# EAGLE design Robot_Board_v003 (EAGLE 6.5.0)
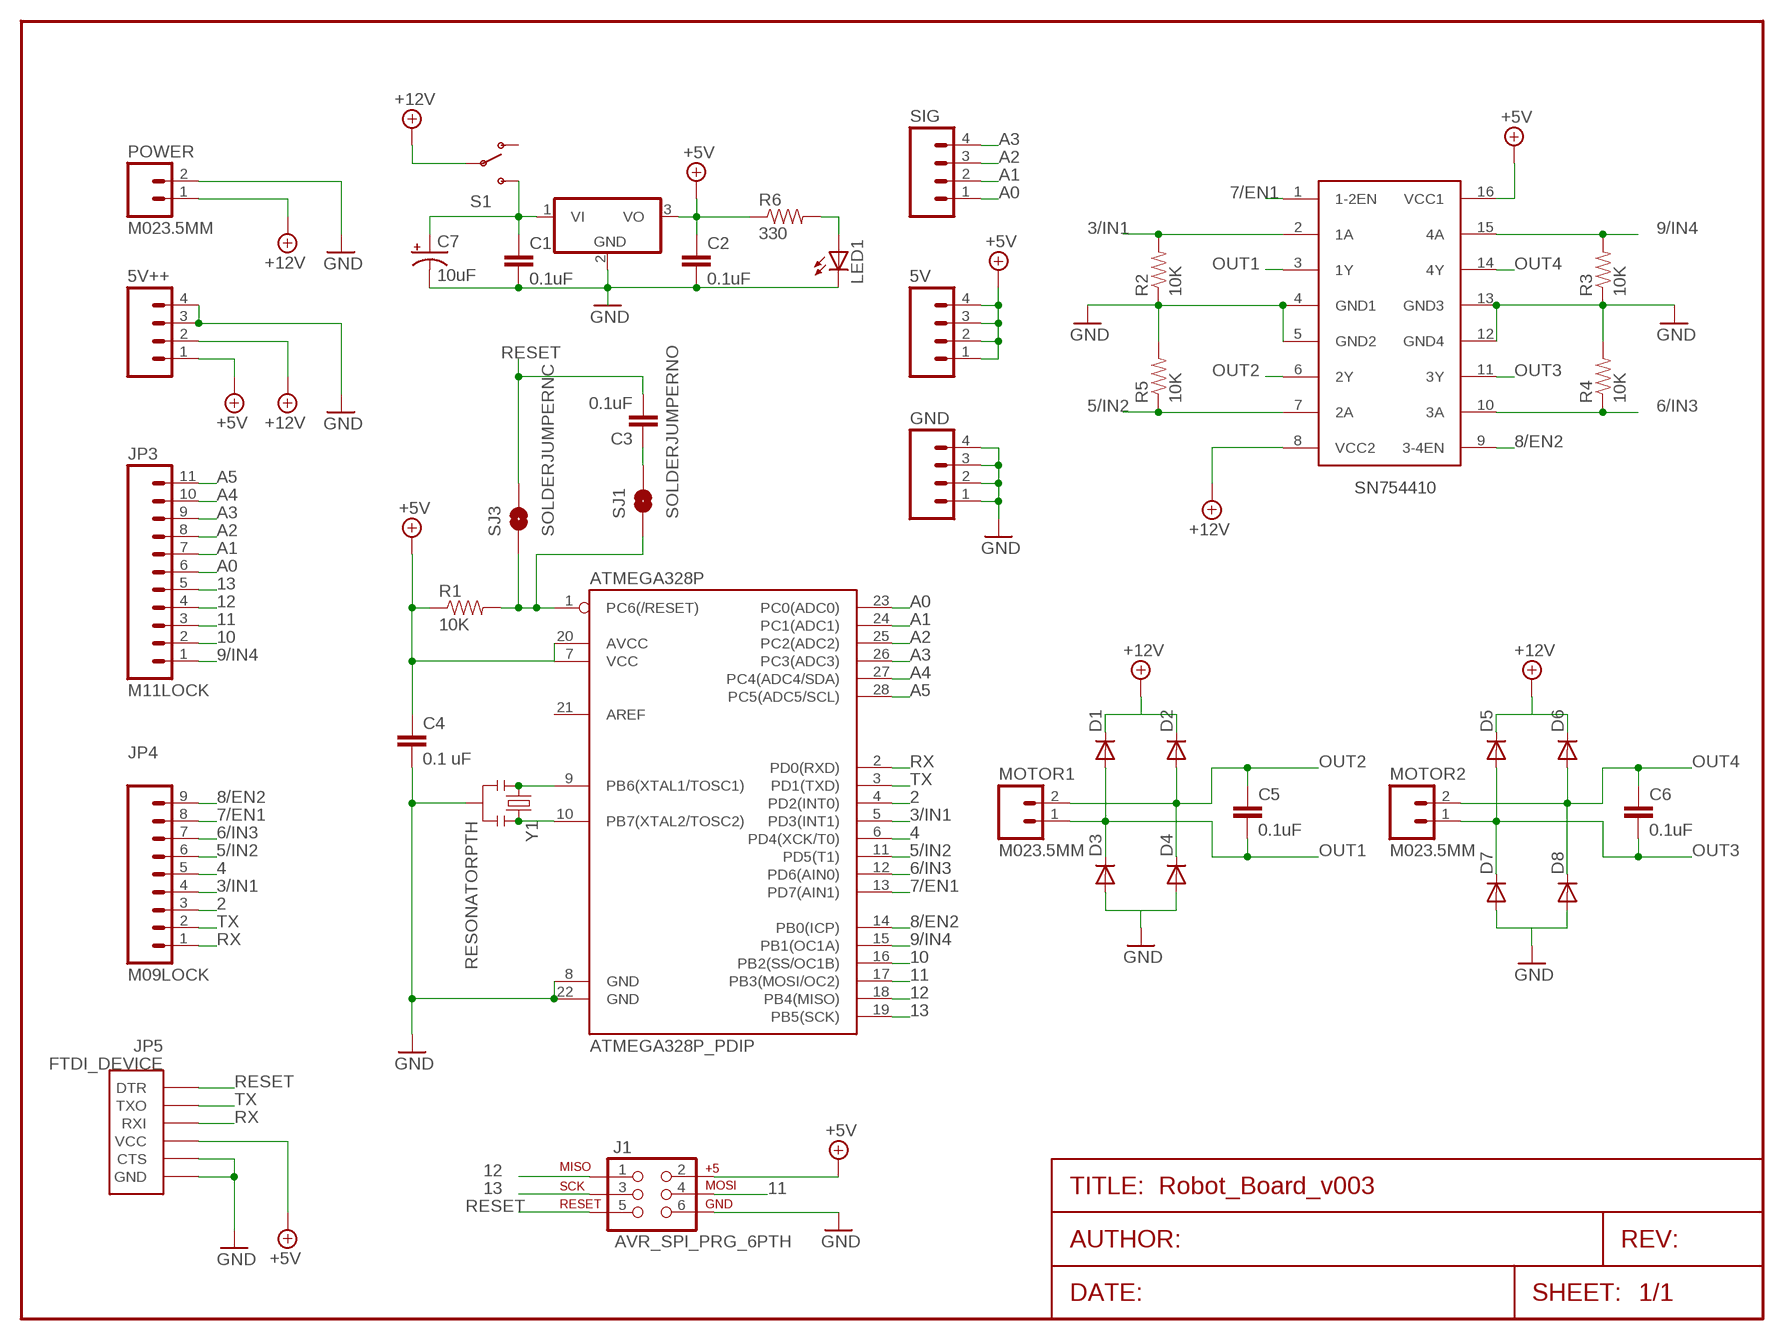
[diagram p0: schematic, sheet 1]

## Parts
5V  M04PTH  [1X04]
5V++  M04LOCK  [1X04_LOCK]
7805  7805TV  [TO220V]
ATMEGA328P  ATMEGA328P_PDIP  [DIL28-3]
C1  0.1uF  CAPPTH1  [CAP-PTH-5MM]
C2  0.1uF  CAPPTH1  [CAP-PTH-5MM]
C3  0.1uF  CAPPTH1  [CAP-PTH-5MM]
C4  0.1 uF  CAPPTH1  [CAP-PTH-5MM]
C5  0.1uF  CAPPTH1  [CAP-PTH-5MM]
C6  0.1uF  CAPPTH1  [CAP-PTH-5MM]
C7  10uF  CAP_POLPTH2  [CPOL-RADIAL-10UF-25V]
D1  DIODEPTH  [DIODE-1N4001]
D2  DIODEPTH  [DIODE-1N4001]
D3  DIODEPTH  [DIODE-1N4001]
D4  DIODEPTH  [DIODE-1N4001]
D5  DIODEPTH  [DIODE-1N4001]
D6  DIODEPTH  [DIODE-1N4001]
D7  DIODEPTH  [DIODE-1N4001]
D8  DIODEPTH  [DIODE-1N4001]
GND  M04PTH  [1X04]
J1  AVR_SPI_PRG_6PTH  [2X3]
JP3  M11LOCK  [1X11_LOCK]
JP4  M09LOCK  [1X09_LOCK]
JP5  FTDI_DEVICE  [FTDI_DEVICE_SIDE]
LED1  LED3MM  [LED3MM]
MOTOR1  M023.5MM  [SCREWTERMINAL-3.5MM-2]
MOTOR2  M023.5MM  [SCREWTERMINAL-3.5MM-2]
POWER  M023.5MM  [SCREWTERMINAL-3.5MM-2]
R1  10K  RESISTORPTH-1/4W  [AXIAL-0.4]
R2  10K  RESISTORPTH-1/4W  [AXIAL-0.4]
R3  10K  RESISTORPTH-1/4W  [AXIAL-0.4]
R4  10K  RESISTORPTH-1/4W  [AXIAL-0.4]
R5  10K  RESISTORPTH-1/4W  [AXIAL-0.4]
R6  330  RESISTORPTH-1/4W  [AXIAL-0.4]
S1  SWITCH-SPDTPTH  [SWITCH-SPDT]
SIG  M04PTH  [1X04]
SJ1  SOLDERJUMPERNO  [SJ_2S-NO]
SJ3  SOLDERJUMPERNC  [SJ_2S]
SN754410  L293D  [DIL16]
Y1  RESONATORPTH  [RESONATOR-PTH]

## Nets
2: ATMEGA328P.4(PD2(INT0)) JP4.3
3/IN1: ATMEGA328P.5(PD3(INT1)) JP4.4 R2.P$2 SN754410.2(1A)
4: ATMEGA328P.6(PD4(XCK/T0)) JP4.5
5/IN2: ATMEGA328P.11(PD5(T1)) JP4.6 R5.P$1 SN754410.7(2A)
6/IN3: ATMEGA328P.12(PD6(AIN0)) JP4.7 R4.P$1 SN754410.10(3A)
7/EN1: ATMEGA328P.13(PD7(AIN1)) JP4.8 SN754410.1(1-2EN)
8/EN2: ATMEGA328P.14(PB0(ICP)) JP4.9 SN754410.9(3-4EN)
9/IN4: ATMEGA328P.15(PB1(OC1A)) JP3.1 R3.P$2 SN754410.15(4A)
10: ATMEGA328P.16(PB2(SS/OC1B)) JP3.2
11: ATMEGA328P.17(PB3(MOSI/OC2)) J1.4 JP3.3
12: ATMEGA328P.18(PB4(MISO)) J1.1 JP3.4
13: ATMEGA328P.19(PB5(SCK)) J1.3 JP3.5
+5V [5V]: 5V++.1 5V.1 5V.2 5V.3 5V.4 7805.3(VO) ATMEGA328P.7(VCC) ATMEGA328P.20(AVCC) C2.1 C4.1 J1.2 JP5.P$4(VCC) R1.P$1 R6.P$1 SN754410.16(VCC1)
+12V [Power]: 5V++.2 D1.C D2.C D5.C D6.C POWER.1 S1.2(P) SN754410.8(VCC2)
A0: ATMEGA328P.23(PC0(ADC0)) JP3.6 SIG.1
A1: ATMEGA328P.24(PC1(ADC1)) JP3.7 SIG.2
A2: ATMEGA328P.25(PC2(ADC2)) JP3.8 SIG.3
A3: ATMEGA328P.26(PC3(ADC3)) JP3.9 SIG.4
A4: ATMEGA328P.27(PC4(ADC4/SDA)) JP3.10
A5: ATMEGA328P.28(PC5(ADC5/SCL)) JP3.11
GND [Power]: 5V++.3 5V++.4 7805.2(GND) ATMEGA328P.8(GND) ATMEGA328P.22(GND) C1.2 C2.2 C4.2 C7.2(-) D3.A D4.A D7.A D8.A GND.1 GND.2 GND.3 GND.4 J1.6 JP5.P$5(CTS) JP5.P$6(GND) LED1.K(C) POWER.2 R2.P$1 R3.P$1 R4.P$2 R5.P$2 SN754410.4(GND1) SN754410.5(GND2) SN754410.12(GND4) SN754410.13(GND3) Y1.2
N$1: ATMEGA328P.9(PB6(XTAL1/TOSC1)) Y1.1
N$2: ATMEGA328P.10(PB7(XTAL2/TOSC2)) Y1.3
N$3: ATMEGA328P.1(PC6(/RESET)) R1.P$2 SJ1.1 SJ3.1
N$4: C3.1 SJ1.2
N$5 [Power]: 7805.1(VI) C1.1 C7.1(+) S1.3(S)
N$6: LED1.A R6.P$2
OUT1 [Power]: C5.2 D1.A D3.C MOTOR1.1 SN754410.3(1Y)
OUT2 [Power]: C5.1 D2.A D4.C MOTOR1.2 SN754410.6(2Y)
OUT3 [Power]: C6.2 D5.A D7.C MOTOR2.1 SN754410.11(3Y)
OUT4 [Power]: C6.1 D6.A D8.C MOTOR2.2 SN754410.14(4Y)
RESET: C3.2 J1.5 JP5.P$1(DTR) SJ3.2
RX: ATMEGA328P.2(PD0(RXD)) JP4.1 JP5.P$3(RXI)
TX: ATMEGA328P.3(PD1(TXD)) JP4.2 JP5.P$2(TXO)
Unconnected: ATMEGA328P.21(AREF) S1.1(O)

## Library data of the parts
5V 5V++ GND SIG = SparkFun-Connectors:M04: Header 4 Standard 4-pin 0.1" header. Use with straight break away headers (SKU : PRT-00116), right angle break away headers (PRT-00553), swiss pins (PRT-00743), machine pins (PRT-00117), and female headers (PRT-00115). Molex polarized connector foot print use with SKU : PRT-08231 with associated crimp pins and housings. 1MM SMD Version SKU: PRT-10208
7805 = linear:78*: Positive VOLTAGE REGULATOR Source: http://cache.national.com/ds/LM/LM78L05.pdf http://www.fairchildsemi.com/ds/LM/LM7805.pdf
ATMEGA328P = SparkFun-DigitalIC:ATMEGA328P_PDIP: uC used in the Arduino 32kb flash, 1k EEPROM, 2k SRAM This is the through-hole version of this chip.
C1-C6 = SparkFun-Passives:CAP: Capacitor Standard 0603 ceramic capacitor, and 0.1" leaded capacitor.
C7 = SparkFun-Passives:CAP_POL: Capacitor Polarized These are standard SMD and PTH capacitors. Normally 10uF, 47uF, and 100uF in electrolytic and tantalum varieties. Always verify the external diameter of the through hole cap, it varies with capacity, voltage, and manufacturer. The EIA devices should be standard.
D1-D8 = SparkFun-DiscreteSemi:DIODE: Diode These are standard reverse protection diodes and small signal diodes. SMA package can handle up to about 1A. SOD-323 can handle about 200mA. What the SOD-323 package when ordering, there are some mfgs out there that are 5-pin packages.
J1 = SparkFun-Connectors:AVR_SPI_PRG_6: AVR ISP 6 Pin This is the reduced ISP connector for AVR programming. Common on Arduino. This footprint will take up less PCB space and can be used with a 10-pin to 6-pin adapter such as SKU: BOB-08508
JP3 = SparkFun-Connectors:M11: Header 11 Standard 11-pin 0.1" header. Use with straight break away headers (SKU : PRT-00116), right angle break away headers (PRT-00553), swiss pins (PRT-00743), machine pins (PRT-00117), and female headers (PRT-00115).
JP4 = SparkFun-Connectors:M09: Header 9 Standard 9-pin 0.1" header. Use with straight break away headers (SKU : PRT-00116), right angle break away headers (PRT-00553), swiss pins (PRT-00743), machine pins (PRT-00117), and female headers (PRT-00115).
JP5 = SparkFun-Connectors:FTDI_DEVICE: Connector which mates to FTDI basic or FTDI cable.
LED1 = SparkFun-LED:LED: LEDs Standard schematic elements and footprints for 5mm, 3mm, 1206, and 0603 sized LEDs. 5mm - Spark Fun Electronics SKU : COM-00529 (and others)
MOTOR1 MOTOR2 POWER = SparkFun-Connectors:M02: Standard 2-pin 0.1" header. Use with - straight break away headers ( PRT-00116) - right angle break away headers (PRT-00553) - swiss pins (PRT-00743) - machine pins (PRT-00117) - female headers (PRT-00115) Molex polarized connector foot print use with: PRT-08233 with associated crimp pins and housings. 2.54_SCREWTERM for use with PRT-10571. 3.5mm Screw Terminal footprints for PRT-08084 5mm Screw Terminal footprints for use with PRT-08433
R1-R6 = SparkFun-Passives:RESISTOR: Resistor Basic schematic elements and footprints for 0603, 1206, and PTH resistors.
S1 = SparkFun-Electromechanical:SWITCH-SPDT: SPDT Switch Simple slide switch, Spark Fun Electronics SKU : COM-00102 DPDT SMT slide switch, AYZ0202, SWCH-08179
SJ1 SJ3 = SparkFun-Passives:SOLDERJUMPER: Solder Jumper Standard SMD solder jumper. Used to automate production. Two varients : Normally Open and Normally Closed are the same, but have different paste layers. NC will have a large amount of paste and should jumper during reflow.
SN754410 = st-microelectronics:L293D: PUSH-PULL 4 CHANNEL DRIVER; MPN: L293D; OC_FARNELL: 9589619; OC_NEWARK: 56P8249
Y1 = SparkFun-FreqCtrl:RESONATOR: Resonator Small SMD resonator. This is the itty bitty 10/20MHz resonators with built in caps. CSTCE10M0G55 and CSTCE20M0V53. Footprint has been reviewed closely but hasn't been tested yet.

## Net classes
0 default: width 0.254 mm, clearance 0.203 mm
1 Power: width 1.27 mm, clearance 0.203 mm
2 5V: width 0.406 mm, clearance 0.203 mm

## Board
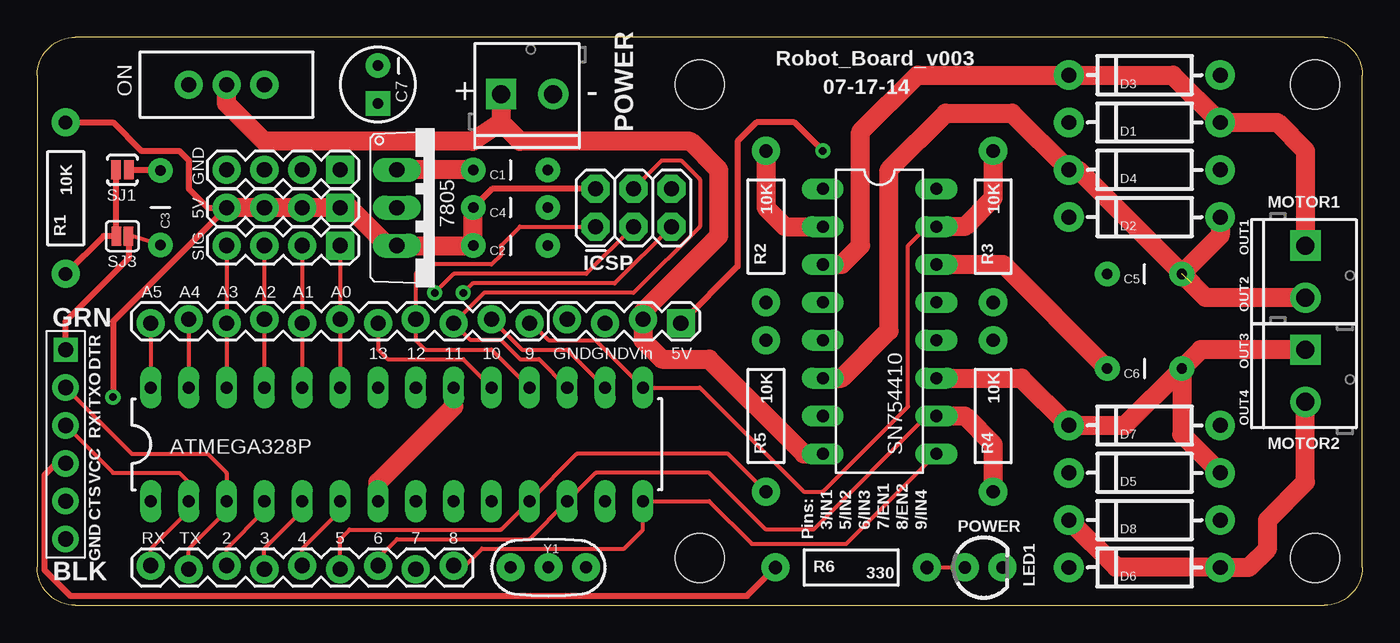
[diagram p1: board, top side]
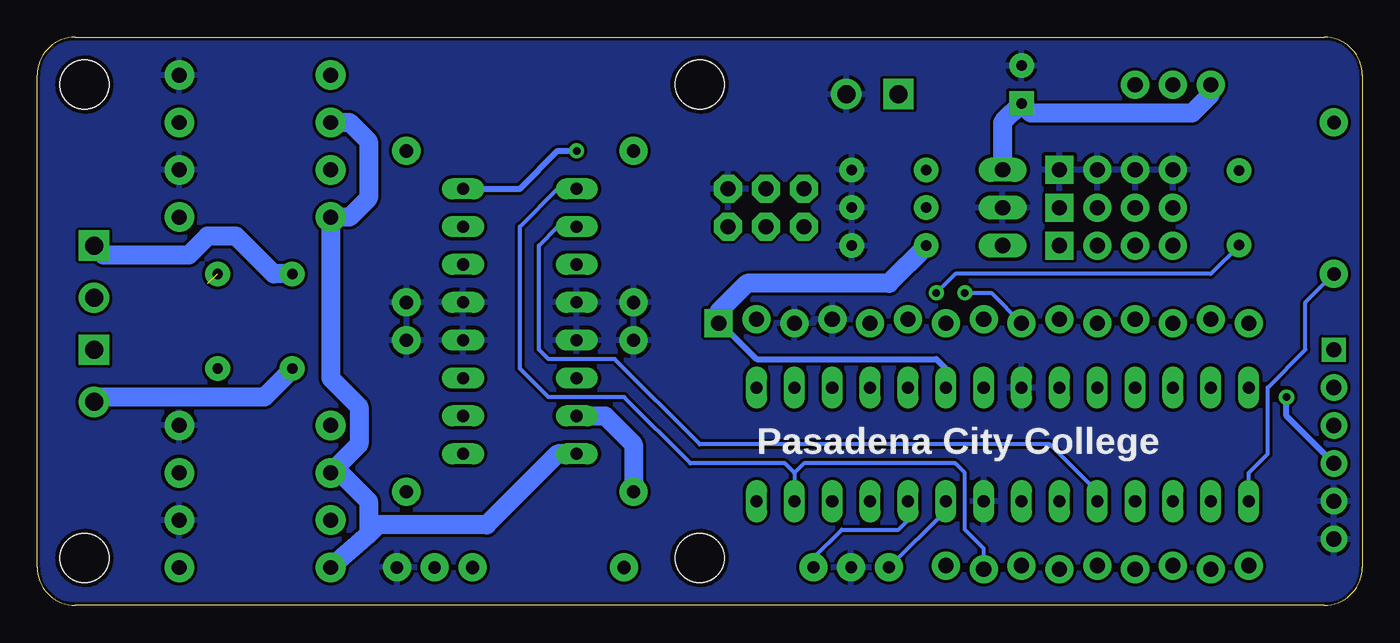
[diagram p2: board, bottom side, seen from below]

Size 88.9 x 38.1 mm. Coordinates in mm from the lower left corner, seen from the top.
Outline: 2.54,0 86.36,0 arc90 88.9,2.54 88.9,35.56 arc90 86.36,38.1 2.54,38.1 arc90 0,35.56 0,2.54 arc90 2.54,0
Copper layers (1*16): Top 0.035mm / dielectric 1.5mm / Bottom 0.035mm
Design rules "ai_2layer": minimum track width 7mil, minimum drill 15mil, track to track 8mil, track to pad 8mil, pad to pad 8mil, via to via 8mil, smd to smd 8mil, copper to edge 8mil, drill to drill 8mil, minimum pad ring 12mil, minimum via ring 10mil, stop-mask expansion 4mil, vias tented up to drill 20mil, thermal gap 10mil

### Footprints (pad centres in the part's own frame; a part is rotated, then mirrored left to right if it is on the bottom)
1X04 = drill 1.016 pad 1.88 square: 1 0,0 | drill 1.016 pad 1.88: 2 2.54,0; 3 5.08,0; 4 7.62,0
1X04_LOCK = drill 1.016 pad 1.88 square: 1 0,0.127 | drill 1.016 pad 1.88: 2 2.54,-0.127; 3 5.08,0.127; 4 7.62,-0.127
TO220V = drill 1.016 long: 1 -2.54,-2.54; 2 0,-2.54; 3 2.54,-2.54
DIL28-3 = drill 0.813 long: 1 -16.51,-3.81; 2 -13.97,-3.81; 3 -11.43,-3.81; 4 -8.89,-3.81; 5 -6.35,-3.81; 6 -3.81,-3.81; 7 -1.27,-3.81; 8 1.27,-3.81; 9 3.81,-3.81; 10 6.35,-3.81; 11 8.89,-3.81; 12 11.43,-3.81; 13 13.97,-3.81; 14 16.51,-3.81; 15 16.51,3.81; 16 13.97,3.81; 17 11.43,3.81; 18 8.89,3.81; 19 6.35,3.81; 20 3.81,3.81; 21 1.27,3.81; 22 -1.27,3.81; 23 -3.81,3.81; 24 -6.35,3.81; 25 -8.89,3.81; 26 -11.43,3.81; 27 -13.97,3.81; 28 -16.51,3.81
CAP-PTH-5MM = drill 0.7 pad 1.651: 1 -2.5,0; 2 2.5,0
CPOL-RADIAL-10UF-25V = drill 0.7 pad 1.651 square: 1 1.27,0 | drill 0.7 pad 1.651: 2 -1.27,0
DIODE-1N4001 = drill 1 pad 1.981: A -5.08,0; C 5.08,0
2X3 = drill 1.016 pad 1.88 octagon: 1 0,0; 2 0,2.54; 3 2.54,0; 4 2.54,2.54; 5 5.08,0; 6 5.08,2.54
1X11_LOCK = drill 1.016 pad 1.88: 1 0,0.127; 2 2.54,-0.127; 3 5.08,0.127; 4 7.62,-0.127; 5 10.16,0.127; 6 12.7,-0.127; 7 15.24,0.127; 8 17.78,-0.127; 9 20.32,0.127; 10 22.86,-0.127; 11 25.4,0.127
1X09_LOCK = drill 1.016 pad 1.88: 1 0,0.127; 2 2.54,-0.127; 3 5.08,0.127; 4 7.62,-0.127; 5 10.16,0.127; 6 12.7,-0.127; 7 15.24,0.127; 8 17.78,-0.127; 9 20.32,0.127
FTDI_DEVICE_SIDE = drill 1 square: P$1 -6.35,0 | drill 1.016 pad 1.778: P$2 -3.81,0; P$3 -1.27,0; P$4 1.27,0; P$5 3.81,0; P$6 6.35,0
LED3MM = drill 0.813 pad 1.88: A -1.27,0; K 1.27,0
SCREWTERMINAL-3.5MM-2 = drill 1.2 pad 2.032 square: 1 0,0 | drill 1.2 pad 2.032: 2 3.5,0
AXIAL-0.4 = drill 0.9 pad 1.88: P$1 -5.08,0; P$2 5.08,0
SWITCH-SPDT = drill 1.016 pad 1.88: 1 0,2.54; 2 0,0; 3 0,-2.54
SJ_2S-NO = smd 0.635 x 1.27: 1 -0.45,0; 2 0.45,0
SJ_2S = smd 0.635 x 1.27: 1 -0.412,0; 2 0.412,0
DIL16 = drill 0.813 long: 1 -8.89,-3.81; 2 -6.35,-3.81; 3 -3.81,-3.81; 4 -1.27,-3.81; 5 1.27,-3.81; 6 3.81,-3.81; 7 6.35,-3.81; 8 8.89,-3.81; 9 8.89,3.81; 10 6.35,3.81; 11 3.81,3.81; 12 1.27,3.81; 13 -1.27,3.81; 14 -3.81,3.81; 15 -6.35,3.81; 16 -8.89,3.81
STAND-OFF = hole 3.302: 0,0
RESONATOR-PTH = drill 0.8 pad 1.88: 1 -2.54,0; 2 0,0; 3 2.54,0

### Placement (x,y rotation side)
5V  20.32,26.67 180 top
5V++  43.18,19.05 180 top
7805  26.67,26.67 270 top
ATMEGA328P  24.13,10.79 0 top
C1  31.75,29.21 0 top
C2  31.75,24.13 0 top
C3  8.26,26.67 270 top
C4  31.75,26.67 0 top
C5  74.3,22.23 180 top
C6  74.3,15.88 0 top
C7  22.86,34.92 270 top
D1  74.3,32.38 180 top
D2  74.3,26.04 180 top
D3  74.3,35.56 180 top
D4  74.3,29.21 180 top
D5  74.3,8.89 180 top
D6  74.3,2.54 180 top
D7  74.3,12.06 180 top
D8  74.3,5.71 180 top
GND  20.32,29.21 180 top
J1  37.47,25.4 0 top
JP3  33.02,19.05 180 top
JP4  7.62,2.54 0 top
JP5  1.91,10.79 270 top
LED1  63.5,2.54 0 top
MOTOR1  85.09,24.13 270 top
MOTOR2  85.09,17.14 270 top
POWER  31.11,34.29 0 top
R1  1.91,27.3 270 top
R2  48.9,25.4 90 top
R3  64.14,25.4 90 top
R4  64.14,12.7 90 top
R5  48.9,12.7 90 top
R6  54.61,2.54 0 top
S1  12.7,34.92 270 top
SIG  20.32,24.13 180 top
SJ1  5.71,29.21 0 top
SJ3  5.71,24.77 0 top
SN754410  56.52,19.05 270 top
U$1  [STAND-OFF]  85.72,3.17 0 top
U$2  [STAND-OFF]  85.72,34.92 0 top
U$3  [STAND-OFF]  44.45,3.17 0 top
U$4  [STAND-OFF]  44.45,34.92 0 top
Y1  34.29,2.54 0 top

### Tracks (layer width: path | path; a pad name or v marks a point on that pad's centre or on a via)
2
  Top 0.254: JP4.3 12.7,3.81 15.24,6.35 ATMEGA328P.4
3/IN1
  Top 0.254: JP4.4 15.24,3.81 17.78,6.35 ATMEGA328P.5
  Top 1.27: R2.P$2 48.9,26.67 50.16,25.4 SN754410.2
  Bottom 0.254: ATMEGA328P.5 17.78,7.62 20.95,10.79 44.45,10.79 50.16,16.51 54.61,16.51 55.24,17.14 55.24,24.13 53.98,25.4 SN754410.2
4
  Top 0.254: JP4.5 17.78,3.81 20.32,6.35 ATMEGA328P.6
5/IN2
  Top 0.254: JP4.6 20.32,4.45 20.95,5.08 31.11,5.08 ATMEGA328P.11 36.2,10.16 46.35,10.16 R5.P$1
  Bottom 1.27: SN754410.7 50.8,12.7 48.9,10.79 R5.P$1
6/IN3
  Top 0.254: SN754410.10 59.69,12.7 52.07,5.08 48.9,5.08 45.09,8.89 37.47,8.89 ATMEGA328P.12 33.02,4.45 24.13,4.45 22.86,3.17 JP4.7
  Top 1.27: SN754410.10 62.23,12.7 64.14,10.79 R4.P$1
7/EN1
  Bottom 0.254: JP4.8 25.4,3.81 26.67,5.08 26.67,8.89 27.3,9.53 37.47,9.53 38.1,8.89 | SN754410.1 53.98,27.94 56.52,25.4 56.52,15.88 54.61,13.97 49.53,13.97 45.09,9.53 38.73,9.53 38.1,8.89 | 38.1,8.89 ATMEGA328P.13
8/EN2
  Top 0.254: JP4.9 28.7,2.67 29.84,3.81 39.37,3.81 40.64,5.08 ATMEGA328P.14 45.09,6.99 47.94,4.13 54.29,4.13 SN754410.9
9/IN4
  Top 0.254: JP3.1 33.15,18.92 34.29,17.78 37.47,17.78 ATMEGA328P.15 44.45,14.61 51.44,7.62 52.7,7.62 58.42,13.34 58.42,24.13 59.69,25.4 SN754410.15
  Top 1.27: R3.P$2 64.14,27.3 62.23,25.4 SN754410.15
10
  Top 0.254: ATMEGA328P.16 35.56,17.14 32.51,17.14 JP3.2
11
  Top 0.254: ATMEGA328P.17 33.66,16.51 32.38,16.51 31.11,17.78 29.08,17.78 JP3.3 29.97,20.95 40.01,20.95 44.45,25.4 44.45,28.57 43.18,29.84 41.91,29.84 J1.4
12
  Top 0.254: ATMEGA328P.18 30.48,17.14 26.04,17.14 25.4,17.78 JP3.4 25.4,22.23 26.04,22.86 30.48,22.86 31.11,23.5 31.11,24.13 32.38,25.4 J1.1
13  (via drill 0.5)
  Top 0.254: JP3.5 22.86,17.14 23.5,16.51 28.57,16.51 ATMEGA328P.19 | v26.67,20.95 27.94,22.23 36.83,22.23 J1.3
  Bottom 0.254: v26.67,20.95 24.89,20.95 JP3.5
+5V  (via drill 0.5)
  Top 0.406: R1.P$1 5.08,32.38 6.99,30.48 9.53,30.48 10.16,29.84 10.16,27.94 11.43,26.67 5V.4 5.08,19.05 v5.08,13.97 | v52.7,30.48 50.8,32.38 48.26,32.38 46.99,31.11 46.99,22.73 5V++.1 | J1.2 30.52,27.94 C4.1 | JP5.P$4 1.27,9.53 0.48,8.73 0.48,2.38 2.22,0.64 47.62,0.64 R6.P$1
  Top 1.27: 5V.4 5V.3 5V.2 5V.1 20.95,26.67 23.5,24.13 7805.3 C2.1 C4.1 | ATMEGA328P.7 22.86,8.26 27.94,13.34 ATMEGA328P.20
  Bottom 0.406: JP5.P$4 5.08,12.7 v5.08,13.97 | SN754410.16 56.52,27.94 53.98,30.48 v52.7,30.48 | 5V++.1 43.05,18.92 40.64,16.51 28.57,16.51 27.94,15.88 ATMEGA328P.20
  Bottom 1.27: C2.1 29.25,24.09 31.75,21.59 41.27,21.59 43.18,19.68 5V++.1
+12V
  Top 1.27: SN754410.8 51.44,10.16 45.09,16.51 41.91,16.51 40.64,17.78 5V++.2 40.64,19.68 45.72,24.77 45.72,29.21 43.81,31.11 32.38,31.11 31.11,32.38 | POWER.1 31.11,32.38 | 31.11,32.38 29.21,31.11 15.24,31.11 12.7,33.66 S1.2
  Bottom 1.27: D1.C 67.94,32.38 66.67,31.11 66.67,27.3 67.94,26.04 D2.C 69.22,15.24 67.31,13.34 67.31,10.79 D5.C 68.58,8.89 66.67,6.99 66.67,4.76 | 66.67,4.76 D6.C | SN754410.8 53.98,10.16 58.74,5.4 66.04,5.4 66.67,4.76
A0
  Top 0.254: SIG.1 JP3.6 ATMEGA328P.23
A1
  Top 0.254: SIG.2 JP3.7 ATMEGA328P.24
A2
  Top 0.254: SIG.3 JP3.8 ATMEGA328P.25
A3
  Top 0.254: SIG.4 JP3.9 ATMEGA328P.26
A4
  Top 0.254: JP3.10 ATMEGA328P.27
A5
  Top 0.254: JP3.11 ATMEGA328P.28
GND
  pour Bottom: 0,38.1 0,0 88.9,0 88.9,38.1
N$1
  Bottom 0.254: Y1.1 27.94,6.35 ATMEGA328P.9
N$2
  Bottom 0.254: Y1.3 36.83,3.17 34.92,5.08 31.11,5.08 30.48,5.71 ATMEGA328P.10
N$3
  Top 0.254: R1.P$2 1.91,21.59
  Top 0.406: R1.P$2 4.45,24.77 SJ3.1 5.26,24.8 SJ1.1
  Bottom 0.254: ATMEGA328P.1 7.62,8.89 6.35,10.16 6.35,14.61 3.81,17.14 3.81,20.32 R1.P$2
N$4
  Top 0.406: SJ1.2 8.21,29.21 C3.1
N$5
  Top 1.27: C1.1 7805.1
  Bottom 1.27: 7805.1 24.13,32.38 C7.1 22.23,33.02 11.43,33.02 10.16,34.29 S1.3
N$6
  Top 0.254: R6.P$2 LED1.A
OUT1
  Top 1.27: MOTOR1.1 85.09,30.48 83.19,32.38 D1.A 76.2,35.56 D3.C 59.05,35.56 55.24,31.75 55.24,24.13 53.98,22.86 SN754410.3
  Bottom 1.27: C5.2 73.03,22.23 75.56,24.77 77.47,24.77 78.74,23.5 84.45,23.5 MOTOR1.1
OUT2  (1 unrouted)
  Top 1.27: MOTOR1.2 78.39,20.63 C5.1 79.38,24.8 D2.A | 77.47,21.59 69.85,29.21 D4.C 65.41,33.02 60.96,33.02 57.15,29.21 57.15,18.41 53.98,15.24 SN754410.6
OUT3
  Top 1.27: MOTOR2.1 78.06,17.14 C6.2 | C6.2 76.8,11.47 D5.A | C6.2 72.98,12.06 D7.C 66.04,15.24 SN754410.11
OUT4
  Top 1.27: D8.C 72.39,2.54 D6.A 81.28,2.54 82.55,3.81 82.55,5.71 85.09,8.26 MOTOR2.2 | SN754410.14 64.81,22.86 C6.1
  Bottom 1.27: C6.1 71.8,15.84 73.66,13.97 84.77,13.97 MOTOR2.2
RESET  (via drill 0.5)
  Top 0.254: C3.2 6.17,24.8 SJ3.2 | v28.57,20.95 29.21,21.59 38.73,21.59 J1.5
  Top 0.406: JP5.P$1 1.91,19.05 6.13,23.27 SJ3.2
  Bottom 0.254: C3.2 8.26,24.13 10.16,22.23 27.3,22.23 v28.57,20.95
RX
  Top 0.254: JP4.1 7.62,3.81 10.16,6.35 ATMEGA328P.2 10.16,8.26 9.53,8.89 5.08,8.89 JP5.P$3
TX
  Top 0.254: JP4.2 10.16,3.81 12.7,6.35 ATMEGA328P.3 12.7,8.89 11.43,10.16 6.35,10.16 JP5.P$2

### Text on the board
tPlace: Robot_Board_v003 | ON | + | - | 07-17-14 | ICSP | OUT1 | A5 | A4 | A3 | A2 | A1 | A0 | OUT2 | 13 | 12 | 11 | 10 | 9 | GND | GND | Vin | 5V | OUT3 | OUT4 | 3/IN1 | 5/IN2 | 6/IN3 | 7/EN1 | 8/EN2 | 9/IN4 | POWER | RX | TX | 2 | 3 | 4 | 5 | 6 | 7 | 8 | Pins:
bPlace: Pasadena City College
tNames: Y1
tValues: 16MHz